# EAGLE design uDiplexer_v1 (EAGLE 9.1.0)
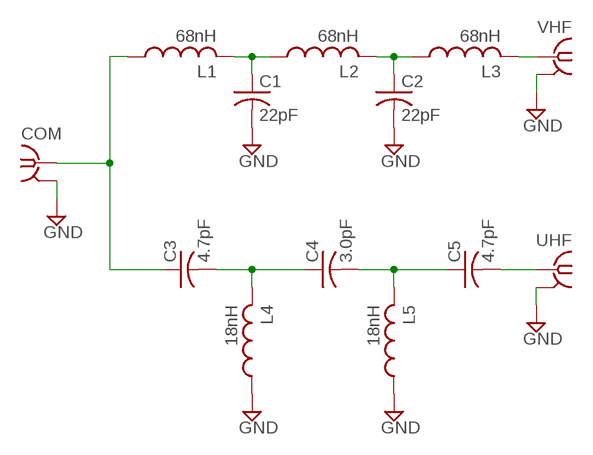
[diagram p0: schematic, sheet 1]

## Parts
C1  22pF  C-USC0805K  [C0805K]
C2  22pF  C-USC0805K  [C0805K]
C3  4.7pF  C-USC0805K  [C0805K]
C4  3.0pF  C-USC0805K  [C0805K]
C5  4.7pF  C-USC0805K  [C0805K]
COM  SMA-142-0711-821/826  [J502-ND-142-0711-821/826]
L1  68nH  L-US0805K  [C0805K]
L2  68nH  L-US0805K  [C0805K]
L3  68nH  L-US0805K  [C0805K]
L4  18nH  L-US0805K  [C0805K]
L5  18nH  L-US0805K  [C0805K]
UHF  SMA-142-0711-821/826  [J502-ND-142-0711-821/826]
VHF  SMA-142-0711-821/826  [J502-ND-142-0711-821/826]

## Nets
GND: C1.2 C2.2 COM.G@1 COM.G@2 COM.G@3 COM.G@4 L4.1 L5.1 UHF.G@1 UHF.G@2 UHF.G@3 UHF.G@4 VHF.G@1 VHF.G@2 VHF.G@3 VHF.G@4
N$1: C1.1 L1.2 L2.1
N$2: C2.1 L2.2 L3.1
N$3: L3.2 VHF.1
N$4: C3.2 C4.1 L4.2
N$5: C4.2 C5.1 L5.2
N$6: C5.2 UHF.1
N$7: C3.1 COM.1 L1.1

## Library data of the parts
C1-C5 = rcl:C-US: CAPACITOR, American symbol; SPICEPREFIX: C
COM UHF VHF = con-coax:SMA-: SMA 50 Ohm End Launch Jack Receptacle - Round Contact Johnson Components Source: www.johnsoncomponents.com .. J502-ND.pdf; MF: JOHNSON COMPONENTS; MPN: 142-0711-821; OC_FARNELL: 1019328; OC_NEWARK: 16F3627
L1-L5 = kj4qlp:L-US0805K

## Board
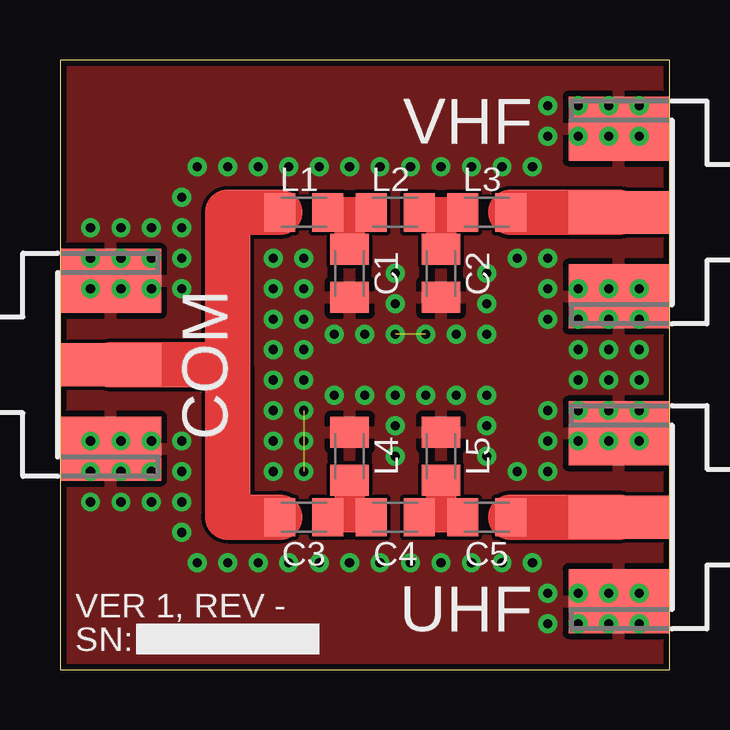
[diagram p1: board, top side]
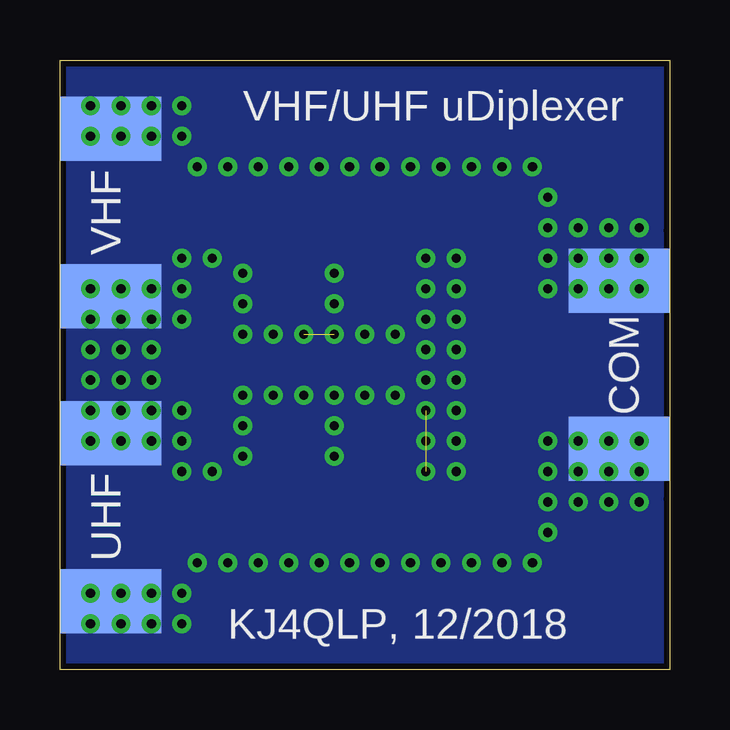
[diagram p2: board, bottom side, seen from below]

Size 25.4 x 25.4 mm. Coordinates in mm from the lower left corner, seen from the top.
Outline: 0,0 25.4,0 25.4,25.4 0,25.4 0,0
Copper layers (1*16): Top 0.035mm / dielectric 1.5mm / Bottom 0.035mm
Design rules "default *": minimum track width 6mil, minimum drill 0.35mm, track to track 6mil, track to pad 6mil, pad to pad 6mil, via to via 6mil, smd to smd 6mil, copper to edge 10mil, drill to drill 6mil, minimum pad ring 10mil, minimum via ring 8mil, stop-mask expansion 4mil, vias tented up to drill 15mil, thermal gap 10mil

### Footprints (pad centres in the part's own frame; a part is rotated, then mirrored left to right if it is on the bottom)
C0805K = smd 1.3 x 1.6: 1 -1,0; 2 1,0
J502-ND-142-0711-821/826 = smd 4.191 x 1.778: 1 2.115,0 | smd 4.191 x 2.667: G@1 2.115,3.495; G@2 2.115,-3.495 | smd 4.191 x 2.667 bottom: G@3 2.115,3.495; G@4 2.115,-3.495

### Placement (x,y rotation side)
C1  12.06,16.51 270 top
C2  15.88,16.51 270 top
C3  10.16,6.35 0 top
C4  13.97,6.35 0 top
C5  17.78,6.35 0 top
COM  0,12.7 0 top
L1  10.16,19.05 0 top
L2  13.97,19.05 0 top
L3  17.78,19.05 0 top
L4  12.06,8.89 270 top
L5  15.88,8.89 270 top
UHF  25.4,6.35 180 top
VHF  25.4,19.05 180 top

### Tracks (layer width: path | path; a pad name or v marks a point on that pad's centre or on a via)
GND  (via drill 0.38)  (3 unrouted)
  other vias: 11.43,13.97 13.97,13.97 12.7,13.97 15.24,13.97 16.51,13.97 11.43,11.43 10.16,13.34 8.89,10.79 8.89,13.34 8.89,12.06 10.16,12.06 12.7,11.43 13.97,11.43 15.24,11.43 16.51,11.43 13.97,15.24 13.97,16.51 8.89,14.61 8.89,15.88 8.89,9.53 8.89,8.26 13.97,10.16 13.97,8.89 17.78,10.16 21.59,12.06 22.86,12.06 24.13,12.06 22.86,13.34 24.13,13.34 21.59,13.34 17.78,15.24 17.78,16.51 19.68,20.95 18.41,20.95 17.14,20.95 15.88,20.95 14.61,20.95 13.34,20.95 12.06,20.95 10.79,20.95 9.53,20.95 8.26,20.95 6.99,20.95 5.71,20.95 5.08,19.68 5.08,18.41 3.81,18.41 2.54,18.41 1.27,18.41 5.08,17.14 5.08,15.88 5.08,9.53 5.08,8.26 5.08,6.99 3.81,6.99 2.54,6.99 1.27,6.99 5.08,5.71 5.71,4.45 6.99,4.45 8.26,4.45 9.53,4.45 10.79,4.45 12.06,4.45 13.34,4.45 14.61,4.45 15.88,4.45 17.14,4.45 18.41,4.45 19.68,4.45 20.32,3.17 20.32,1.91 20.32,22.23 20.32,23.5 21.59,22.23 22.86,22.23 24.13,22.23 21.59,23.5 22.86,23.5 24.13,23.5 21.59,14.61 22.86,14.61 24.13,14.61 24.13,15.88 22.86,15.88 21.59,15.88 19.05,17.14 20.32,17.14 20.32,15.88 20.32,14.61 17.78,8.89 19.05,8.26 20.32,8.26 20.32,9.53 20.32,10.79 21.59,10.79 22.86,10.79 24.13,10.79 21.59,9.53 22.86,9.53 24.13,9.53 21.59,1.91 22.86,1.91 24.13,1.91 24.13,3.17 22.86,3.17 21.59,3.17 3.81,8.26 2.54,8.26 1.27,8.26 1.27,9.53 2.54,9.53 3.81,9.53 3.81,15.88 2.54,15.88 1.27,15.88 1.27,17.14 2.54,17.14 3.81,17.14 10.16,9.53 10.16,8.26 17.78,11.43 17.78,13.97 10.16,14.61 10.16,15.88 10.16,17.14 8.89,17.14 10.16,10.79
  pour Bottom (no thermals): 0,25.4 0,0 25.4,0 25.4,25.4
  pour Top: 0,25.4 25.4,25.4 25.4,0 0,0
N$1
  Top 1.27: L1.2 12.06,19.05 | 12.06,19.05 L2.1 | C1.1 12.06,19.05
N$2
  Top 1.27: L2.2 15.88,19.05 | 15.88,19.05 L3.1 | 15.88,19.05 C2.1
N$3
  Top 1.905: L3.2 VHF.1
N$4
  Top 1.27: C3.2 12.06,6.35 | 12.06,6.35 C4.1 | L4.2 12.06,6.35
N$5
  Top 1.27: C4.2 15.88,6.35 | 15.88,6.35 C5.1 | L5.2 15.88,6.35
N$6
  Top 1.905: UHF.1 C5.2
N$7
  Top 1.905: COM.1 6.99,12.7 | 6.99,12.7 6.99,19.05 L1.1 | 6.99,12.7 6.99,6.35 C3.1

### Text on the board
tPlace: VER 1, REV - | SN:
bPlace: VHF/UHF uDiplexer | VHF | COM | UHF | KJ4QLP, 12/2018